# EAGLE design billdetector1b (EAGLE 5.11)
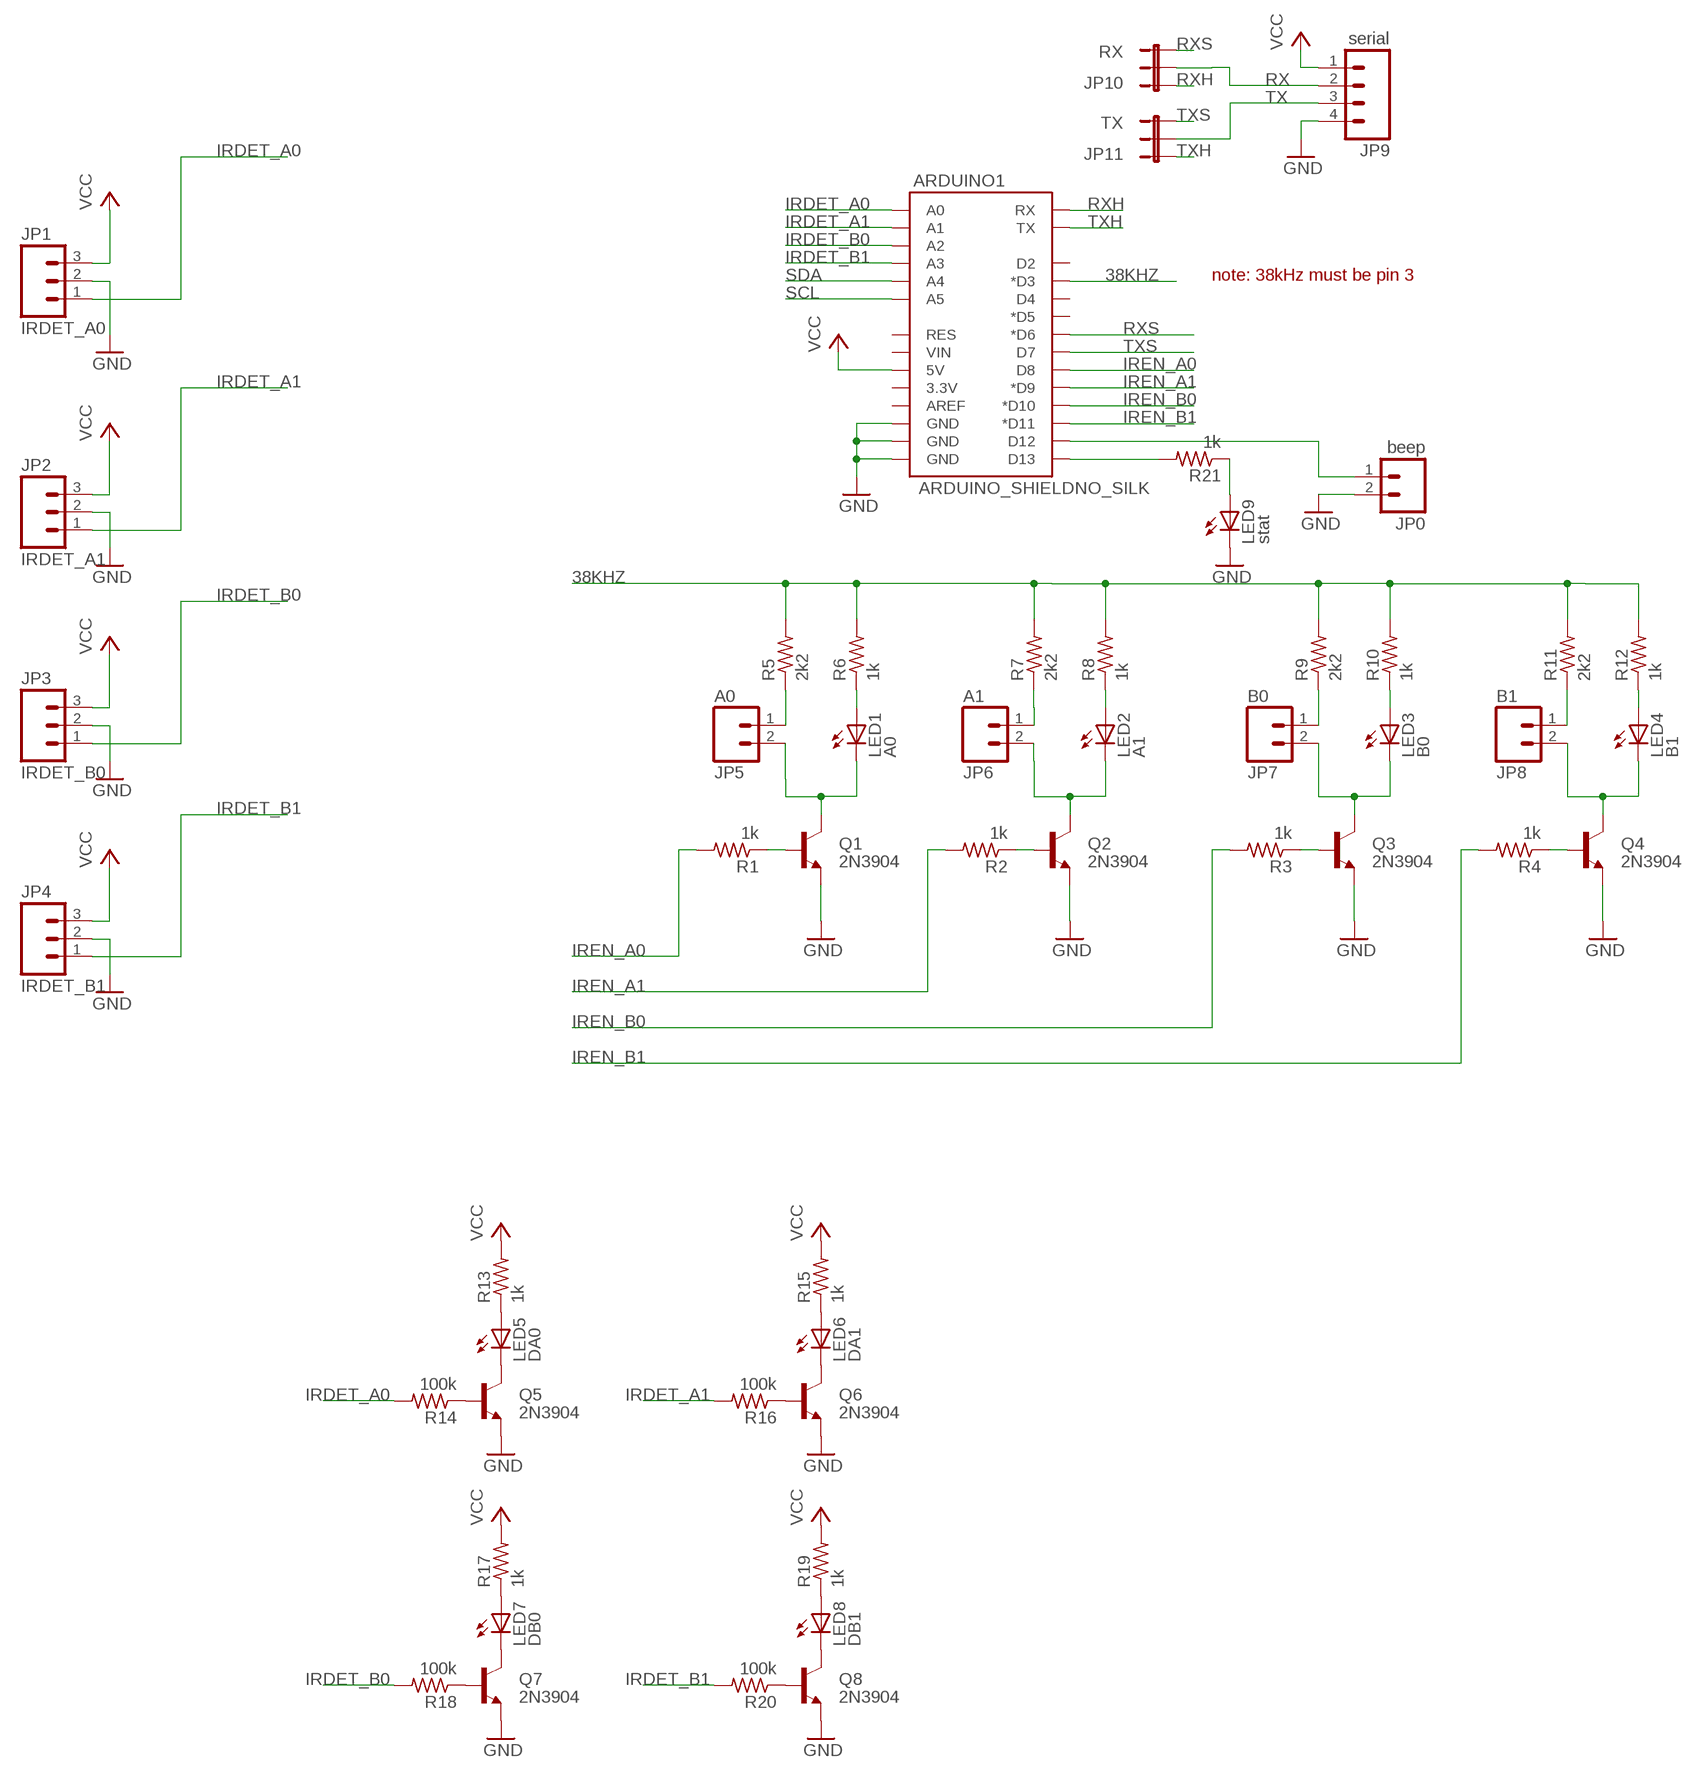
[diagram p0: schematic, sheet 1]

## Parts
ARDUINO1  ARDUINO_SHIELDNO_SILK  [DUEMILANOVE_VIAS]
JP0  beep  M02LOCK  [1X02_LOCK]
JP1  IRDET_A0  M03POLAR_LOCK  [MOLEX-1X3_LOCK]
JP2  IRDET_A1  M03POLAR_LOCK  [MOLEX-1X3_LOCK]
JP3  IRDET_B0  M03POLAR_LOCK  [MOLEX-1X3_LOCK]
JP4  IRDET_B1  M03POLAR_LOCK  [MOLEX-1X3_LOCK]
JP5  A0  M02POLAR_LOCK  [MOLEX-1X2_LOCK]
JP6  A1  M02POLAR_LOCK  [MOLEX-1X2_LOCK]
JP7  B0  M02POLAR_LOCK  [MOLEX-1X2_LOCK]
JP8  B1  M02POLAR_LOCK  [MOLEX-1X2_LOCK]
JP9  serial  M04POLAR_LOCK  [MOLEX-1X4_LOCK]
JP10  RX  JUMPER-3PTH  [1X03]
JP11  TX  JUMPER-3PTH  [1X03]
LED1  A0  LED3MM  [LED3MM]
LED2  A1  LED3MM  [LED3MM]
LED3  B0  LED3MM  [LED3MM]
LED4  B1  LED3MM  [LED3MM]
LED5  DA0  LED3MM  [LED3MM]
LED6  DA1  LED3MM  [LED3MM]
LED7  DB0  LED3MM  [LED3MM]
LED8  DB1  LED3MM  [LED3MM]
LED9  stat  LED3MM  [LED3MM]
Q1  2N3904  TRANSISTOR_NPNTO92  [TO-92]
Q2  2N3904  TRANSISTOR_NPNTO92  [TO-92]
Q3  2N3904  TRANSISTOR_NPNTO92  [TO-92]
Q4  2N3904  TRANSISTOR_NPNTO92  [TO-92]
Q5  2N3904  TRANSISTOR_NPNTO92  [TO-92]
Q6  2N3904  TRANSISTOR_NPNTO92  [TO-92]
Q7  2N3904  TRANSISTOR_NPNTO92  [TO-92]
Q8  2N3904  TRANSISTOR_NPNTO92  [TO-92]
R1  1k  R-US_0204/5  [0204/5]
R2  1k  R-US_0204/5  [0204/5]
R3  1k  R-US_0204/5  [0204/5]
R4  1k  R-US_0204/5  [0204/5]
R5  2k2  R-US_0204/5  [0204/5]
R6  1k  R-US_0204/5  [0204/5]
R7  2k2  R-US_0204/5  [0204/5]
R8  1k  R-US_0204/5  [0204/5]
R9  2k2  R-US_0204/5  [0204/5]
R10  1k  R-US_0204/5  [0204/5]
R11  2k2  R-US_0204/5  [0204/5]
R12  1k  R-US_0204/5  [0204/5]
R13  1k  R-US_0204/5  [0204/5]
R14  100k  R-US_0204/5  [0204/5]
R15  1k  R-US_0204/5  [0204/5]
R16  100k  R-US_0204/5  [0204/5]
R17  1k  R-US_0204/5  [0204/5]
R18  100k  R-US_0204/5  [0204/5]
R19  1k  R-US_0204/5  [0204/5]
R20  100k  R-US_0204/5  [0204/5]
R21  1k  R-US_0204/5  [0204/5]

## Nets
38KHZ: ARDUINO1.D3(*D3) R5.2 R6.2 R7.2 R8.2 R9.2 R10.2 R11.2 R12.2
GND: ARDUINO1.GND@0(GND) ARDUINO1.GND@1(GND) ARDUINO1.GND@2(GND) JP0.2 JP1.2 JP2.2 JP3.2 JP4.2 JP9.4 LED9.K(C) Q1.1(E) Q2.1(E) Q3.1(E) Q4.1(E) Q5.1(E) Q6.1(E) Q7.1(E) Q8.1(E)
IRDET_A0: ARDUINO1.A0 JP1.1 R14.2
IRDET_A1: ARDUINO1.A1 JP2.1 R16.2
IRDET_B0: ARDUINO1.A2 JP3.1 R18.2
IRDET_B1: ARDUINO1.A3 JP4.1 R20.2
IREN_A0: ARDUINO1.D8 R1.2
IREN_A1: ARDUINO1.D9(*D9) R2.2
IREN_B0: ARDUINO1.D10(*D10) R3.2
IREN_B1: ARDUINO1.D11(*D11) R4.2
N$1: Q3.2(B) R3.1
N$2: Q4.2(B) R4.1
N$3: JP6.1 R7.1
N$4: JP5.2 LED1.K(C) Q1.3(C)
N$5: Q1.2(B) R1.1
N$6: Q2.2(B) R2.1
N$7: ARDUINO1.D12 JP0.1
N$8: ARDUINO1.D13 R21.2
N$9: LED1.A R6.1
N$10: LED2.A R8.1
N$11: JP6.2 LED2.K(C) Q2.3(C)
N$12: LED5.A R13.1
N$13: JP5.1 R5.1
N$14: LED5.K(C) Q5.3(C)
N$15: LED3.A R10.1
N$16: LED4.A R12.1
N$17: JP7.1 R9.1
N$18: JP8.1 R11.1
N$19: JP7.2 LED3.K(C) Q3.3(C)
N$20: JP8.2 LED4.K(C) Q4.3(C)
N$21: Q5.2(B) R14.1
N$22: LED6.A R15.1
N$23: LED6.K(C) Q6.3(C)
N$24: Q6.2(B) R16.1
N$25: LED7.A R17.1
N$26: LED7.K(C) Q7.3(C)
N$27: Q7.2(B) R18.1
N$28: LED8.A R19.1
N$29: LED8.K(C) Q8.3(C)
N$30: Q8.2(B) R20.1
N$31: LED9.A R21.1
RX: JP9.2 JP10.2
RXH: ARDUINO1.RX JP10.1
RXS: ARDUINO1.D6(*D6) JP10.3
SCL: ARDUINO1.A5
SDA: ARDUINO1.A4
TX: JP9.3 JP11.2
TXH: ARDUINO1.TX JP11.1
TXS: ARDUINO1.D7 JP11.3
VCC: ARDUINO1.5V JP1.3 JP2.3 JP3.3 JP4.3 JP9.1 R13.2 R15.2 R17.2 R19.2
Unconnected: ARDUINO1.3.3V ARDUINO1.AREF ARDUINO1.D2 ARDUINO1.D4 ARDUINO1.D5(*D5) ARDUINO1.RES ARDUINO1.VIN

## Notes on the sheet
- note: 38kHz must be pin 3

## Library data of the parts
ARDUINO1 = SparkFun-20110517:ARDUINO_SHIELD
JP0 JP5-JP8 = SparkFun-20110517:M02: Header 2 Standard 2-pin 0.1" header. Use with straight break away headers (SKU : PRT-00116), right angle break away headers (PRT-00553), swiss pins (PRT-00743), machine pins (PRT-00117), and female headers (PRT-00115). Molex polarized connector foot print use with SKU : PRT-08233 with associated crimp pins and housings.
JP1-JP4 = SparkFun-20110517:M03: Header 3 Standard 3-pin 0.1" header. Use with straight break away headers (SKU : PRT-00116), right angle break away headers (PRT-00553), swiss pins (PRT-00743), machine pins (PRT-00117), and female headers (PRT-00115). Molex polarized connector foot print use with SKU : PRT-08232 with associated crimp pins and housings.
JP9 = SparkFun-20110517:M04: Header 4 Standard 4-pin 0.1" header. Use with straight break away headers (SKU : PRT-00116), right angle break away headers (PRT-00553), swiss pins (PRT-00743), machine pins (PRT-00117), and female headers (PRT-00115). Molex polarized connector foot print use with SKU : PRT-08231 with associated crimp pins and housings. 1MM SMD Version SKU: PRT-10208
JP10 JP11 = SparkFun-20110517:JUMPER-3
LED1-LED9 = SparkFun-20110517:LED: LEDs Standard schematic elements and footprints for 5mm, 3mm, 1206, and 0603 sized LEDs. 5mm - Spark Fun Electronics SKU : COM-00529 (and others)
Q1-Q8 = SparkFun-20110517:TRANSISTOR_NPN: Transistor NPN BJT configuration in SOT23 package. MMBT2222 is the common NPN we use. Double check BCE configuration again layout.
R1-R21 = rcl:R-US_: RESISTOR, American symbol

## Board
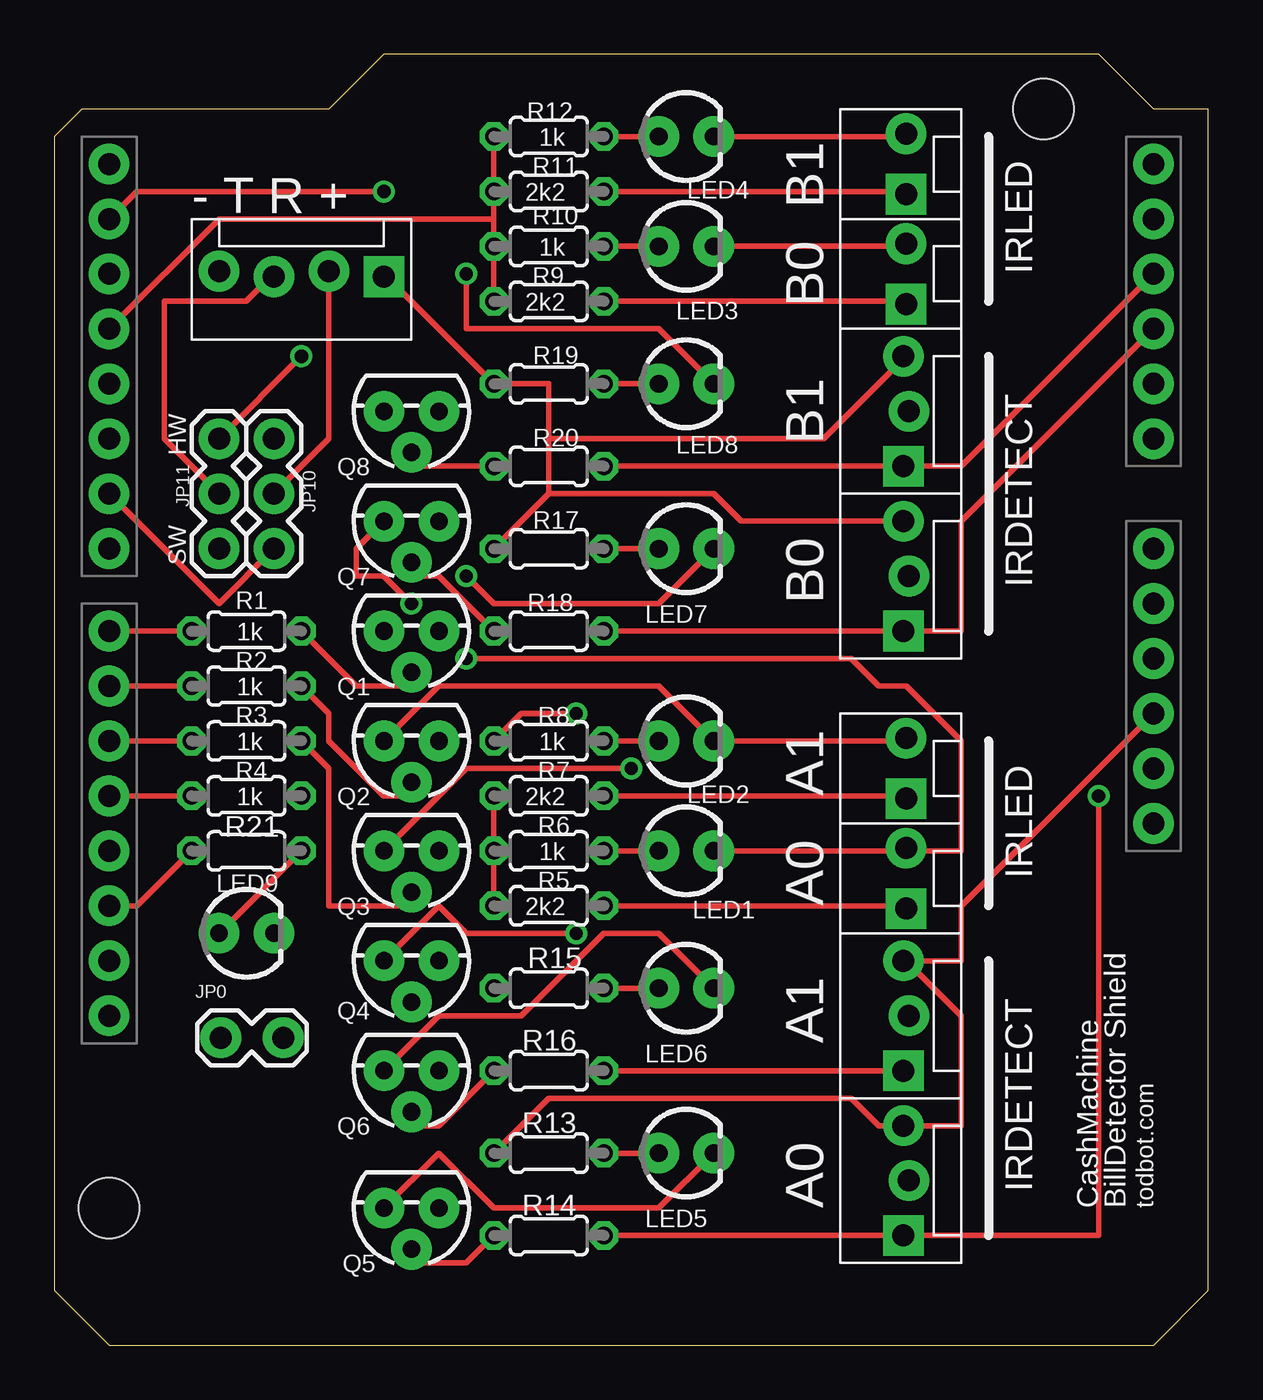
[diagram p1: board, top side]
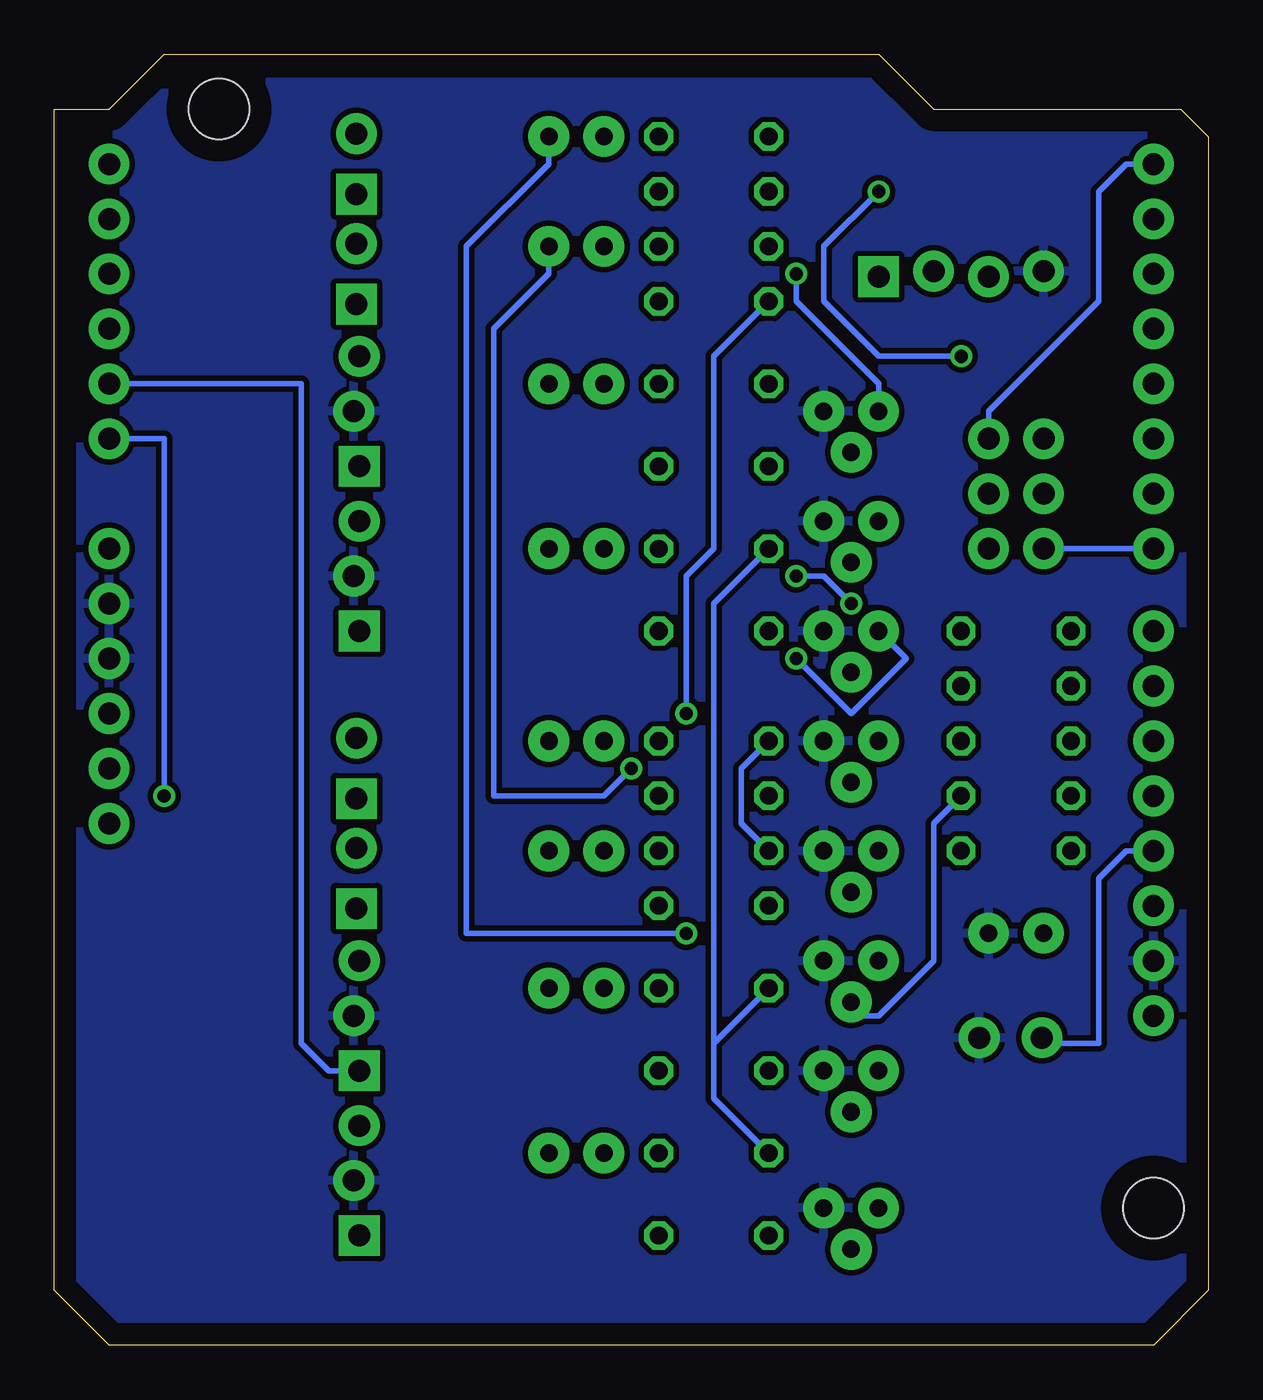
[diagram p2: board, bottom side, seen from below]

Size 53.34 x 59.69 mm. Coordinates in mm from the lower left corner, seen from the top.
Outline: 2.54,0 50.8,0 53.34,2.54 53.34,57.15 50.8,57.15 48.26,59.69 15.24,59.69 12.7,57.15 1.27,57.15 0,55.88 0,2.54 2.54,0
Copper layers (1*16): Top 0.035mm / dielectric 1.5mm / Bottom 0.035mm
Design rules "default *": minimum track width 10mil, minimum drill 24mil, track to track 10mil, track to pad 10mil, pad to pad 10mil, via to via 10mil, smd to smd 8mil, copper to edge 40mil, drill to drill 8mil, minimum pad ring 10mil, minimum via ring 8mil, stop-mask expansion 4mil, vias tented up to drill 0mil, thermal gap 10mil
Holes 2.8 mm at 45.72,57.15 2.54,6.35

### Footprints (pad centres in the part's own frame; a part is rotated, then mirrored left to right if it is on the bottom)
DUEMILANOVE_VIAS = drill 1.016 pad 1.88 round: 3.3V 50.8,13.97; 5V 50.8,16.51; A0 50.8,29.21; A1 50.8,31.75; A2 50.8,34.29; A3 50.8,36.83; A4 50.8,39.37; A5 50.8,41.91; AREF 2.54,2.54; D2 2.54,36.83; D3 2.54,34.29; D4 2.54,31.75; D5 2.54,29.21; D6 2.54,26.67; D7 2.54,24.13; D8 2.54,20.32; D9 2.54,17.78; D10 2.54,15.24; D11 2.54,12.7; D12 2.54,10.16; D13 2.54,7.62; GND@0 50.8,19.05; GND@1 50.8,21.59; GND@2 2.54,5.08; RES 50.8,11.43; RX 2.54,41.91; TX 2.54,39.37; VIN 50.8,24.13
1X02_LOCK = drill 1.016 pad 1.88 round: 1 -0.178,0; 2 2.718,0
MOLEX-1X3_LOCK = drill 1.016 pad 1.88 square: 1 0,0.127 | drill 1.016 pad 1.88 round: 2 2.54,-0.127; 3 5.08,0.127
MOLEX-1X2_LOCK = drill 1.016 pad 1.88 square: 1 -0.127,0 | drill 1.016 pad 1.88 round: 2 2.667,0
MOLEX-1X4_LOCK = drill 1.016 pad 1.88 square: 1 0,0.127 | drill 1.016 pad 1.88 round: 2 2.54,-0.127; 3 5.08,0.127; 4 7.62,-0.127
1X03 = drill 1.016 pad 1.88 round: 1 0,0; 2 2.54,0; 3 5.08,0
LED3MM = drill 0.813 pad 1.88 round: A -1.27,0; K 1.27,0
TO-92 = drill 0.813 pad 1.88 round: 1 -1.27,0; 2 0,1.905; 3 1.27,0
0204/5 = drill 0.813 octagon: 1 -2.54,0; 2 2.54,0

### Placement (x,y rotation side)
ARDUINO1  0,12.7 0 top
JP0  7.87,14.22 0 top
JP1  39.37,5.08 90 top
JP2  39.37,12.7 90 top
JP3  39.37,33.02 90 top
JP4  39.37,40.64 90 top
JP5  39.37,20.32 90 top
JP6  39.37,25.4 90 top
JP7  39.37,48.26 90 top
JP8  39.37,53.34 90 top
JP9  15.24,49.53 180 top
JP10  10.16,41.91 270 top
JP11  7.62,41.91 270 top
LED1  29.21,22.86 0 top
LED2  29.21,27.94 0 top
LED3  29.21,50.8 0 top
LED4  29.21,55.88 0 top
LED5  29.21,8.89 0 top
LED6  29.21,16.51 0 top
LED7  29.21,36.83 0 top
LED8  29.21,44.45 0 top
LED9  8.89,19.05 0 top
Q1  16.51,33.02 180 top
Q2  16.51,27.94 180 top
Q3  16.51,22.86 180 top
Q4  16.51,17.78 180 top
Q5  16.51,6.35 180 top
Q6  16.51,12.7 180 top
Q7  16.51,38.1 180 top
Q8  16.51,43.18 180 top
R1  8.89,33.02 180 top
R2  8.89,30.48 180 top
R3  8.89,27.94 180 top
R4  8.89,25.4 180 top
R5  22.86,20.32 180 top
R6  22.86,22.86 180 top
R7  22.86,25.4 180 top
R8  22.86,27.94 180 top
R9  22.86,48.26 180 top
R10  22.86,50.8 180 top
R11  22.86,53.34 180 top
R12  22.86,55.88 180 top
R13  22.86,8.89 180 top
R14  22.86,5.08 0 top
R15  22.86,16.51 180 top
R16  22.86,12.7 0 top
R17  22.86,36.83 180 top
R18  22.86,33.02 0 top
R19  22.86,44.45 180 top
R20  22.86,40.64 0 top
R21  8.89,22.86 180 top

### Tracks (layer width: path | path; a pad name or v marks a point on that pad's centre or on a via)
38KHZ  (via drill 0.61)
  Top 0.254: R5.2 R6.2 R7.2 | R9.2 R10.2 20.32,52.07 | R12.2 R11.2 20.32,52.07 | ARDUINO1.D3 7.62,52.07 20.32,52.07 | R8.2 21.59,29.21 v24.13,29.21
  Bottom 0.254: R8.2 21.59,26.67 21.59,24.13 R6.2 | v24.13,29.21 24.13,35.56 22.86,36.83 22.86,45.72 R9.2
GND
  pour Bottom: 1.27,0 53.34,0 53.34,58.42 0,58.42
IRDET_A0  (via drill 0.61)
  Top 0.254: JP1.1 39.37,5.08 | R14.2 JP1.1 | JP1.1 39.37,5.08 | v48.26,25.4 48.26,5.08 39.37,5.08 | JP1.1 39.37,5.08
  Bottom 0.254: ARDUINO1.A0 48.26,41.91 v48.26,25.4
IRDET_A1
  Top 0.254: JP2.1 39.37,12.7 JP2.1 | R16.2 JP2.1
  Bottom 0.254: ARDUINO1.A1 41.91,44.45 41.91,13.97 40.64,12.7 39.37,12.7 JP2.1
IRDET_B0
  Top 0.254: JP3.1 39.37,33.02 | R18.2 JP3.1 | JP3.1 39.37,33.02 | ARDUINO1.A2 41.91,38.1 41.91,33.02 39.37,33.02 | JP3.1 39.37,33.02
IRDET_B1
  Top 0.254: JP4.1 39.37,40.64 | R20.2 JP4.1 | JP4.1 39.37,40.64 | ARDUINO1.A3 41.91,40.64 39.37,40.64 | JP4.1 39.37,40.64
IREN_A0
  Top 0.254: ARDUINO1.D8 R1.2
IREN_A1
  Top 0.254: ARDUINO1.D9 R2.2
IREN_B0
  Top 0.254: ARDUINO1.D10 R3.2
IREN_B1
  Top 0.254: ARDUINO1.D11 R4.2
N$1
  Top 0.254: R3.1 12.7,26.67 12.7,20.32 16.51,20.32 Q3.2
N$2
  Bottom 0.254: R4.1 12.7,24.13 12.7,17.78 15.24,15.24 16.51,15.24 Q4.2
N$3
  Top 0.254: R7.1 39.37,25.4 JP6.1
N$4  (via drill 0.61)
  Top 0.254: 39.37,22.86 LED1.K | 39.37,22.86 JP5.2 39.37,22.86 | v19.05,31.75 36.83,31.75 38.1,30.48 39.37,30.48 41.91,27.94 41.91,22.86 39.37,22.86
  Bottom 0.254: Q1.3 13.97,31.75 16.51,29.21 v19.05,31.75
N$5
  Top 0.254: R1.1 13.97,30.48 16.51,30.48 Q1.2
N$6
  Top 0.254: R2.1 12.7,29.21 12.7,27.94 15.24,25.4 16.51,25.4 Q2.2
N$7
  Bottom 0.254: ARDUINO1.D12 3.81,22.86 5.08,21.59 5.08,13.97 7.62,13.97 JP0.1
N$8
  Top 0.254: R21.2 3.81,20.32 ARDUINO1.D13
N$9
  Top 0.254: R6.1 LED1.A
N$10
  Top 0.254: R8.1 LED2.A
N$11
  Top 0.254: Q2.3 17.78,30.48 27.94,30.48 LED2.K 39.37,27.94 JP6.2
N$12
  Top 0.254: R13.1 LED5.A
N$13
  Top 0.254: R5.1 39.37,20.32 JP5.1
N$14
  Top 0.254: Q5.3 17.78,8.89 20.32,6.35 27.94,6.35 LED5.K
N$15
  Top 0.254: R10.1 LED3.A
N$16
  Top 0.254: R12.1 LED4.A
N$17
  Top 0.254: R9.1 39.37,48.26 JP7.1
N$18
  Top 0.254: R11.1 39.37,53.34 JP8.1
N$19  (via drill 0.61)
  Top 0.254: Q3.3 19.05,26.67 v26.67,26.67 | LED3.K 39.37,50.8 JP7.2
  Bottom 0.254: v26.67,26.67 27.94,25.4 33.02,25.4 33.02,46.99 30.48,49.53 LED3.K
N$20  (via drill 0.61)
  Top 0.254: Q4.3 17.78,20.32 19.05,19.05 v24.13,19.05 | LED4.K 39.37,55.88 JP8.2
  Bottom 0.254: v24.13,19.05 34.29,19.05 34.29,50.8 30.48,54.61 LED4.K
N$21
  Top 0.254: R14.1 19.05,3.81 16.51,3.81 Q5.2
N$22
  Top 0.254: R15.1 LED6.A
N$23
  Top 0.254: Q6.3 17.78,15.24 21.59,15.24 25.4,19.05 27.94,19.05 LED6.K
N$24
  Top 0.254: R16.1 17.78,10.16 16.51,10.16 Q6.2
N$25
  Top 0.254: R17.1 LED7.A
N$26  (via drill 0.61)
  Top 0.254: Q7.3 13.97,36.83 13.97,35.56 15.24,35.56 v16.51,34.29 | v19.05,35.56 20.32,34.29 27.94,34.29 LED7.K
  Bottom 0.254: v16.51,34.29 17.78,35.56 v19.05,35.56
N$27
  Top 0.254: R18.1 17.78,35.56 16.51,35.56 Q7.2
N$28
  Top 0.254: R19.1 LED8.A
N$29  (via drill 0.61)
  Top 0.254: v19.05,49.53 19.05,46.99 27.94,46.99 LED8.K
  Bottom 0.254: Q8.3 15.24,44.45 19.05,48.26 v19.05,49.53
N$30
  Top 0.254: R20.1 16.51,40.64 Q8.2
N$31
  Top 0.254: LED9.A R21.1
RX
  Top 0.254: JP10.2 12.7,41.91 12.7,49.53 JP9.2
RXH
  Bottom 0.254: JP10.1 10.16,43.18 5.08,48.26 5.08,53.34 3.81,54.61 ARDUINO1.RX
RXS
  Top 0.254: ARDUINO1.D6 7.62,34.29 JP10.3
TX
  Top 0.254: JP11.2 5.08,41.91 5.08,48.26 8.89,48.26 10.16,49.53 JP9.3
TXH  (via drill 0.61)
  Top 0.254: ARDUINO1.TX 3.81,53.34 v15.24,53.34 | JP11.1 v11.43,45.72
  Bottom 0.254: v15.24,53.34 17.78,50.8 17.78,48.26 15.24,45.72 v11.43,45.72
TXS
  Bottom 0.254: ARDUINO1.D7 JP11.3
VCC
  Top 0.254: R17.2 22.86,39.37 | 22.86,41.91 22.86,44.45 R19.2 15.24,49.53 JP9.1 | 22.86,39.37 22.86,41.91 | JP3.3 31.75,38.1 30.48,39.37 22.86,39.37 | JP3.3 39.37,38.1 JP3.3 | 22.86,41.91 35.56,41.91 39.37,45.72 JP4.3 | R13.2 22.86,11.43 36.83,11.43 38.1,10.16 JP1.3 | JP1.3 39.37,10.16 | JP1.3 39.37,10.16 | 39.37,17.78 41.91,15.24 41.91,10.16 39.37,10.16 | 39.37,17.78 JP2.3 39.37,17.78 | JP1.3 39.37,10.16 | ARDUINO1.5V 41.91,20.32 41.91,17.78 39.37,17.78
  Bottom 0.254: 22.86,13.97 R15.2 | 22.86,13.97 22.86,11.43 R13.2 | R17.2 22.86,34.29 22.86,13.97

### Text on the board
tPlace: B1 | - T R + | IRLED | B0 | B1 | HW | SW | IRDETECT | B0 | A1 | IRLED | A0 | A1 | IRDETECT | A0 | CashMachine | BillDetector Shield | todbot.com